# Altium schematic sheet connectors-external.SchDoc
size A3
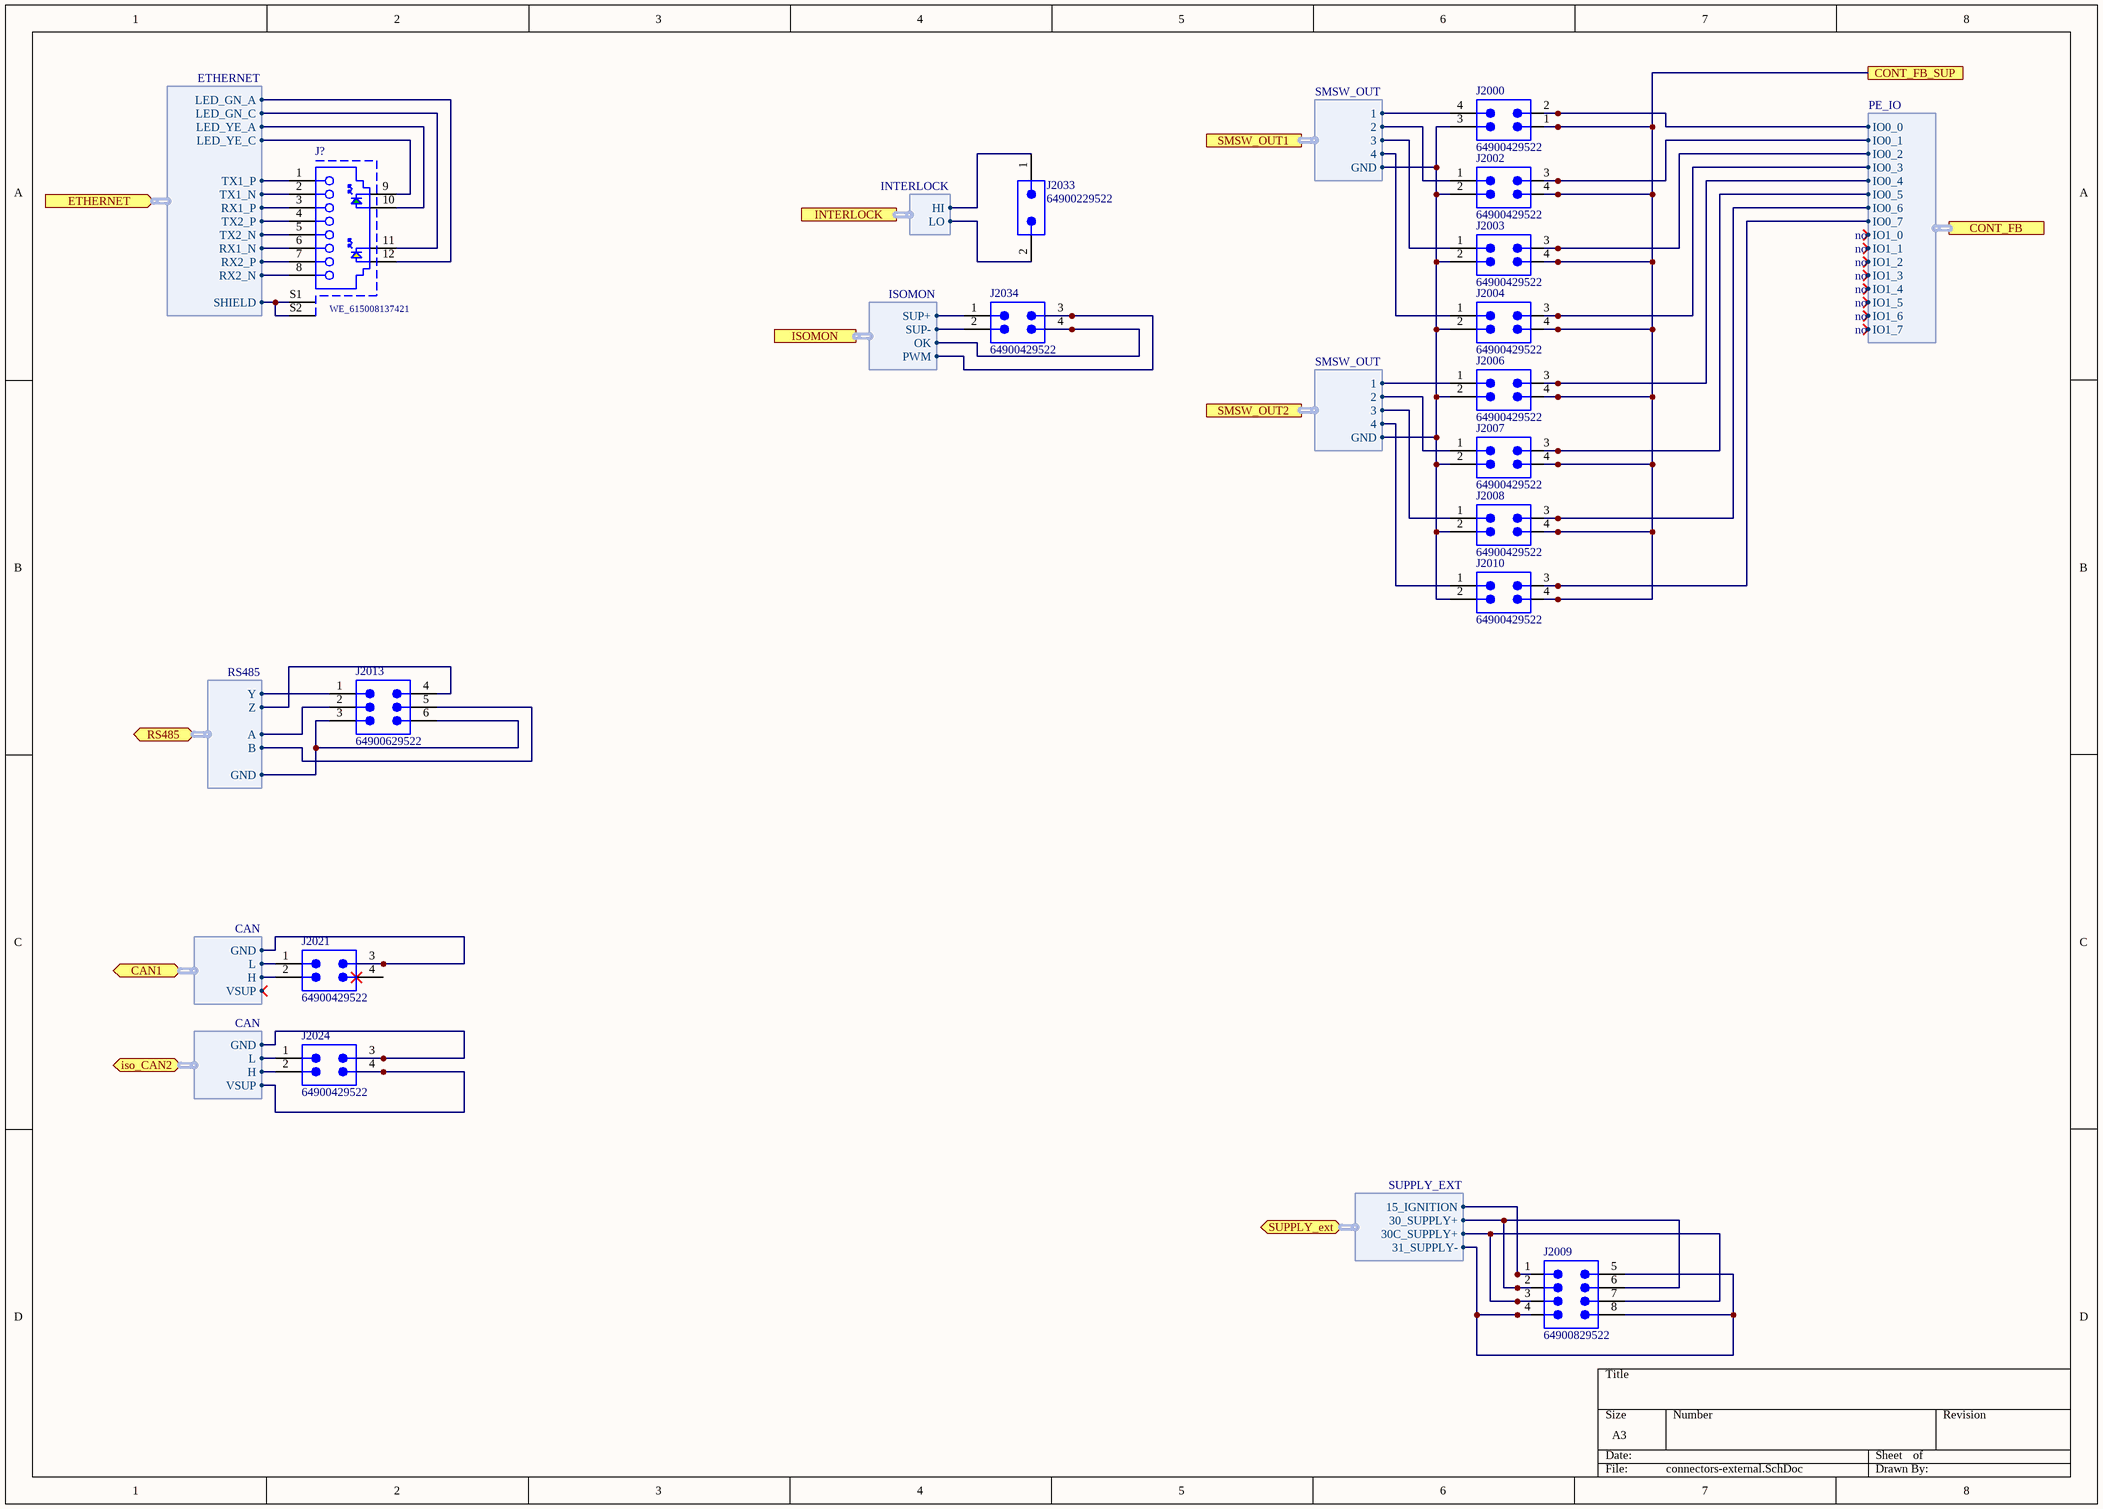
[diagram p0: connectors-external.SchDoc]

## Parts
J2000  64900429522  [64900429522]
J2002  64900429522  [64900429522]
J2003  64900429522  [64900429522]
J2004  64900429522  [64900429522]
J2006  64900429522  [64900429522]
J2007  64900429522  [64900429522]
J2008  64900429522  [64900429522]
J2009  64900829522  [64900829522]
J2010  64900429522  [64900429522]
J2013  64900629522  [64900629522]
J2021  64900429522  [64900429522]
J2024  64900429522  [64900429522]
J2033  64900229522  [64900229522]
J2034  64900429522  [64900429522]
J?  WE_615008137421  [WE_615008137421]

## Ports
CAN1 (bidir, harness CAN), CONT_FB (harness PE_IO), CONT_FB_SUP, ETHERNET (in, harness ETHERNET), INTERLOCK (harness INTERLOCK), iso_CAN2 (bidir, harness CAN), ISOMON (harness ISOMON), RS485 (bidir, harness RS485), SMSW_OUT1 (harness SMSW_OUT), SMSW_OUT2 (harness SMSW_OUT), SUPPLY_ext (bidir, harness SUPPLY_EXT)

## Harnesses
RS485: Y, Z, A, B, GND
SMSW_OUT: 1, 2, 3, 4, GND
PE_IO: IO0_0, IO0_1, IO0_2, IO0_3, IO0_4, IO0_5, IO0_6, IO0_7, IO1_0, IO1_1, IO1_2, IO1_3, IO1_4, IO1_5, IO1_6, IO1_7
ISOMON: SUP+, SUP-, OK, PWM
CAN: H, L, GND, VSUP
INTERLOCK: HI, LO
ETHERNET: TX1_P, TX1_N, RX1_P, TX2_P, TX2_N, RX1_N, RX2_P, RX2_N, SHIELD, LED_YE_C, LED_YE_A, LED_GN_C, LED_GN_A
SUPPLY_EXT: 30_SUPPLY+, 31_SUPPLY-, 15_IGNITION, 30C_SUPPLY+

## Nets
CONT_FB_SUP: J2000.1 J2002.4 J2003.4 J2004.4 J2006.4 J2007.4 J2008.4 J2010.4 ; port CONT_FB_SUP
NetJ2000_2: J2000.2 ; port CONT_FB.IO0_0
NetJ2000_3: J2000.3 J2002.2 J2003.2 J2004.2 J2006.2 J2007.2 J2008.2 J2010.2 ; port SMSW_OUT1.GND, port SMSW_OUT2.GND
NetJ2000_4: J2000.4 ; port SMSW_OUT1.1
NetJ2002_1: J2002.1 ; port SMSW_OUT1.2
NetJ2002_3: J2002.3 ; port CONT_FB.IO0_1
NetJ2003_1: J2003.1 ; port SMSW_OUT1.3
NetJ2003_3: J2003.3 ; port CONT_FB.IO0_2
NetJ2004_1: J2004.1 ; port SMSW_OUT1.4
NetJ2004_3: J2004.3 ; port CONT_FB.IO0_3
NetJ2006_1: J2006.1 ; port SMSW_OUT2.1
NetJ2006_3: J2006.3 ; port CONT_FB.IO0_4
NetJ2007_1: J2007.1 ; port SMSW_OUT2.2
NetJ2007_3: J2007.3 ; port CONT_FB.IO0_5
NetJ2008_1: J2008.1 ; port SMSW_OUT2.3
NetJ2008_3: J2008.3 ; port CONT_FB.IO0_6
NetJ2009_1: J2009.1 ; port SUPPLY_ext.15_IGNITION
NetJ2009_2: J2009.2 J2009.6 ; port SUPPLY_ext.30_SUPPLY+
NetJ2009_3: J2009.3 J2009.7 ; port SUPPLY_ext.30C_SUPPLY+
NetJ2009_4: J2009.4 J2009.5 J2009.8 ; port SUPPLY_ext.31_SUPPLY-
NetJ2010_1: J2010.1 ; port SMSW_OUT2.4
NetJ2010_3: J2010.3 ; port CONT_FB.IO0_7
NetJ2013_1: J2013.1 ; port RS485.Y
NetJ2013_2: J2013.2 ; port RS485.A
NetJ2013_3: J2013.3 J2013.6 ; port RS485.GND
NetJ2013_4: J2013.4 ; port RS485.Z
NetJ2013_5: J2013.5 ; port RS485.B
NetJ2021_1: J2021.1 ; port CAN1.L
NetJ2021_2: J2021.2 ; port CAN1.H
NetJ2021_3: J2021.3 ; port CAN1.GND
NetJ2024_1: J2024.1 ; port iso_CAN2.L
NetJ2024_2: J2024.2 ; port iso_CAN2.H
NetJ2024_3: J2024.3 ; port iso_CAN2.GND
NetJ2024_4: J2024.4 ; port iso_CAN2.VSUP
NetJ2033_1: J2033.1 ; port INTERLOCK.HI
NetJ2033_2: J2033.2 ; port INTERLOCK.LO
NetJ2034_1: J2034.1 ; port ISOMON.SUP+
NetJ2034_2: J2034.2 ; port ISOMON.SUP-
NetJ2034_3: J2034.3 ; port ISOMON.PWM
NetJ2034_4: J2034.4 ; port ISOMON.OK
NetJ?_1: J?.1 ; port ETHERNET.TX1_P
NetJ?_2: J?.2 ; port ETHERNET.TX1_N
NetJ?_3: J?.3 ; port ETHERNET.RX1_P
NetJ?_4: J?.4 ; port ETHERNET.TX2_P
NetJ?_5: J?.5 ; port ETHERNET.TX2_N
NetJ?_6: J?.6 ; port ETHERNET.RX1_N
NetJ?_7: J?.7 ; port ETHERNET.RX2_P
NetJ?_8: J?.8 ; port ETHERNET.RX2_N
NetJ?_9: J?.9 ; port ETHERNET.LED_YE_C
NetJ?_10: J?.10 ; port ETHERNET.LED_YE_A
NetJ?_11: J?.11 ; port ETHERNET.LED_GN_C
NetJ?_12: J?.12 ; port ETHERNET.LED_GN_A
NetJ?_S1: J?.S1 J?.S2 ; port ETHERNET.SHIELD

Not connected (* = marked no-connect by the designer): J2021 4

## Notes on the sheet
- not used

## Library data of the parts
J2000 J2002-J2004 J2006-J2008 J2010 J2021 J2024 J2034 = CMP-1502-00518-2: NexarPartId: 8917584; Insulation Resistance: 1GΩ; Connector Type: Male Pin, Socket; Gender: Male; Number of Positions: 4; Contact Resistance: 10mΩ; Insulation: Insulated; Operating Supply Voltage: 600V; Pitch: 4.2mm; Row Spacing: 5.5118mm; Current Rating: 8A; Height: 12.8mm; Contact Gender: Male; Color: White; Length: 9.6mm; Mount: Through Hole; Width: 9.6mm; Termination: Through Hole; Flammability Rating: UL94 V-0; Number of Pins: 4; Contact Material: Copper; REACH SVHC: Unknown; Lead Pitch: 4.2mm; Number of Rows: 2; RoHS: Compliant; Min Operating Temperature: -40°C; Housing Material: Nylon; Fastening Type: Ramp; Max Operating Temperature: 105°C; Voltage Rating: 600V; Contact Plating: Tin; Number of Contacts: 4
J2009 = CMP-1502-00520-2: NexarPartId: 8917586; Operating Supply Voltage: 600V; Lead Length: 3.6mm; Current Rating: 7A; Connector Type: Male Pin, Socket; Number of Positions: 8; Row Spacing: 5.5118mm; Insulation Resistance: 1GΩ; Contact Resistance: 10mΩ; Pitch: 4.2mm; Gender: Male; Min Operating Temperature: -40°C; Height: 12.8mm; Lead Pitch: 4.2mm; Number of Rows: 2; Number of Pins: 8; Length: 18mm; Housing Material: Nylon; Mount: Through Hole; Color: White; RoHS: Compliant; Width: 18mm; Contact Gender: Male; Voltage Rating: 600V; Contact Material: Copper; Termination: Through Hole; Max Operating Temperature: 105°C; Flammability Rating: UL94 V-0; REACH SVHC: Unknown; Fastening Type: Ramp; Number of Contacts: 8; Contact Plating: Tin
J2013 = CMP-1502-00519-2: NexarPartId: 8917585; Operating Supply Voltage: 600V; Connector Type: Male Pin, Socket; Pitch: 4.2mm; Row Spacing: 5.5118mm; Insulation Resistance: 1GΩ; Gender: Male; Number of Contacts: 6; Insulation: Insulated; Contact Resistance: 10mΩ; Current Rating: 8A; Max Operating Temperature: 105°C; Contact Gender: Male; Length: 13.8mm; Fastening Type: Ramp; Mount: Through Hole; Flammability Rating: UL94 V-0; Termination: Through Hole; Lead Pitch: 4.2mm; Housing Material: Nylon; Color: White; Number of Rows: 2; Number of Pins: 6; Voltage Rating: 600V; RoHS: Compliant; Width: 13.8mm; Min Operating Temperature: -40°C; Height: 12.8mm; Contact Plating: Tin; Number of Positions: 6; Contact Material: Copper; REACH SVHC: Unknown
J2033 = CMP-1502-00517-2: NexarPartId: 8917583; Operating Supply Voltage: 600V; Connector Type: Male Pin, Socket; Gender: Male; Current Rating: 9A; Insulation: Insulated; Insulation Resistance: 1GΩ; Number of Positions: 2; Contact Resistance: 10mΩ; Row Spacing: 5.5118mm; Pitch: 4.2mm; Contact Material: Copper; RoHS: Compliant; Lead Pitch: 4.2mm; Min Operating Temperature: -40°C; Housing Material: Nylon; Width: 5.4mm; Color: White; Number of Pins: 2; Mount: Through Hole; Number of Rows: 2; Fastening Type: Ramp; Flammability Rating: UL94 V-0; Termination: Through Hole; Height: 12.8mm; Length: 5.4mm; Contact Plating: Tin; Contact Gender: Male; Number of Contacts: 2; Max Operating Temperature: 105°C; REACH SVHC: Unknown; Voltage Rating: 600V
J? = WE_615008137421: Modular Jack WR-MJ, Tab Up; Manufacturer: Würth; Pin Number: 8P8C; Port: 1x1; Entrance: Horizontal; Compliance: Lead free / RoHS; Rated Current: 1.5 A; Working Voltage: 125 VAC; Withstanding Voltage: 1000 VAC; Contact Resistance: 30 mOhm; Circuits: 12; Rated Voltage: 120V AC; Automotive Qualified: False; ComponentLink1Description: Datasheet; ComponentLink1URL: https://www.we-online.com/katalog/datasheet/615008137421.pdf; ComponentLink2Description: Datasheet; ComponentLink2URL: https://katalog.we-online.de/em/datasheet/615008185121.pdf; Part Number: WE_615008137421; Published Date: July 2018; Publisher: Wurth Elektronik; Operating Temperature: −40 °C - +85 °C; Mounting Technology: THT; Packaging: Tray; Part Name: WE_615008137421; Supplier 1: Mouser; Supplier Part Number 1: 710-615008137421; Supplier 3: Wuerth Electronics; Supplier Part Number 3: 615008137421; ECCN: EAR99